# EAGLE schematic lsu_001 (EAGLE 9.4.1)
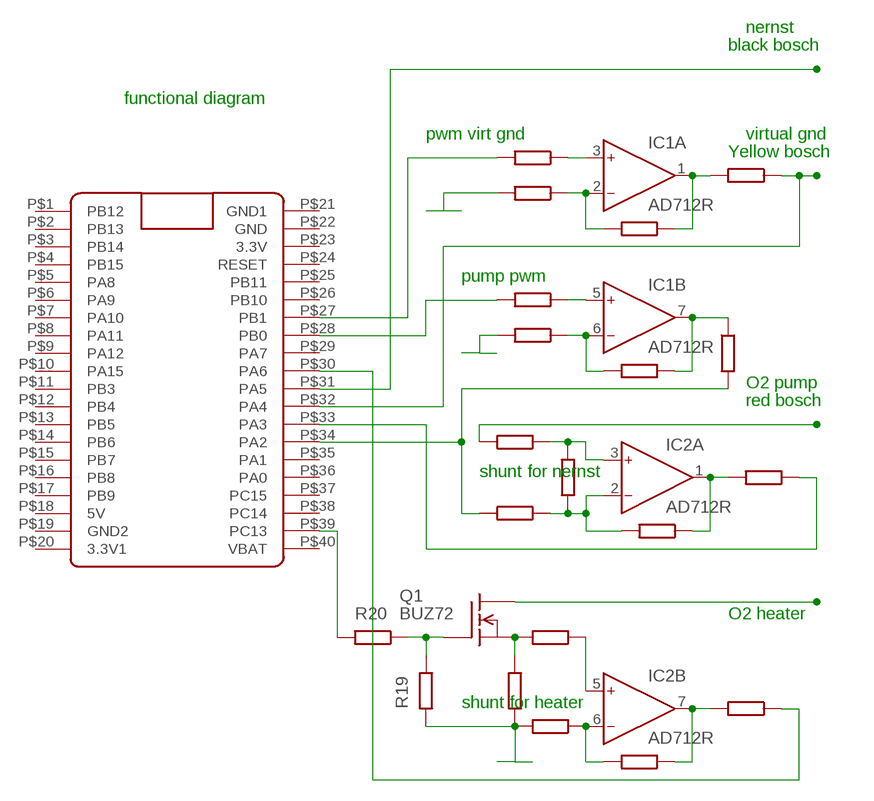
[diagram p0: schematic, sheet 1]

## Parts
IC1  AD712R  [SO8]
IC2  AD712R  [SO8]
Q1  BUZ72  [TO220]
R19  R  (no package)
R20  R  (no package)
U$1  BLUE_PILL  [BLUE_PILL]

## Nets
N$1: IC1.1(A:OUT)
N$2: IC1.7(B:OUT)
N$3: IC1.2(A:IN-)
N$4: Q1.3(S)
N$5: IC1.6(B:IN-)
N$6: IC1.5(B:IN+)
N$7: IC2.6(B:IN-)
N$8: IC2.7(B:OUT)
N$9: IC2.2(A:IN-)
N$10: IC2.1(A:OUT)
N$11: IC2.3(A:IN+)
N$12: IC1.3(A:IN+)
N$13: U$1.P$28(PB0)
N$14: U$1.P$27(PB1)
N$17: U$1.P$34(PA2)
N$18: U$1.P$32(PA4)
N$19: R20.2 U$1.P$39(PC13)
N$20: R19.1
N$21: IC2.5(B:IN+)
N$22: Q1.2(D)
N$23: U$1.P$31(PA5)
N$24: U$1.P$33(PA3)
N$25: U$1.P$30(PA6)
N$27: Q1.1(G) R19.2 R20.1
Unconnected: U$1.P$1(PB12) U$1.P$2(PB13) U$1.P$3(PB14) U$1.P$4(PB15) U$1.P$5(PA8) U$1.P$6(PA9) U$1.P$7(PA10) U$1.P$8(PA11) U$1.P$9(PA12) U$1.P$10(PA15) U$1.P$11(PB3) U$1.P$12(PB4) U$1.P$13(PB5) U$1.P$14(PB6) U$1.P$15(PB7) U$1.P$16(PB8) U$1.P$17(PB9) U$1.P$18(5V) U$1.P$19(GND2) U$1.P$20(3.3V1) U$1.P$22(GND) U$1.P$23(3.3V) U$1.P$24(RESET) U$1.P$25(PB11) U$1.P$26(PB10) U$1.P$29(PA7) U$1.P$35(PA1) U$1.P$36(PA0) U$1.P$37(PC15) U$1.P$38(PC14) U$1.P$40(VBAT)

## Notes on the sheet
- nernst
- black bosch
- functional diagram
- pwm virt gnd | virtual gnd
- Yellow bosch
- pump pwm
- O2 pump
- red bosch
- shunt for nernst
- O2 heater
- shunt for heater

## Power pins joined to a net without a drawn wire
GND1: U$1.P$21(GND1)
V+: IC1.8(P:V+) IC2.8(P:V+)
V-: IC1.4(P:V-) IC2.4(P:V-)

## Library data of the parts
IC1 IC2 = analog-devices:AD712: Dual Precision, Low Cost, High Speed BiFET Op Amp Source: http://www.analog.com/static/imported-files/data_sheets/AD712.pdf; MF: ALTERA CORPORATION; MPN: AD712KRZ; OC_FARNELL: 1263975; OC_NEWARK: 59K4556
Q1 = transistor-fet:BUZ72: N-Channel Enhancement MOSFET 100V; 10A; 0,2Ohm
R19 R20 = ngspice-simulation:R: RESISTOR
U$1 = BluePill:BLUE_PILL